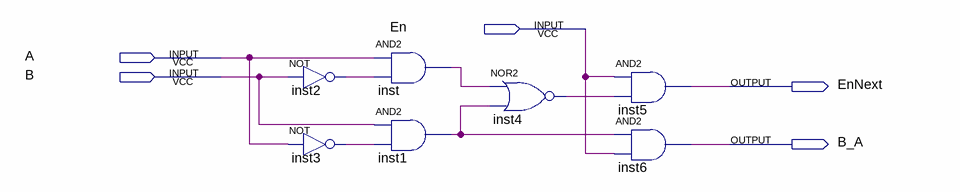
[diagram p0: schematic sheet]
// Quartus schematic Comparador_1bit.bdf as structural Verilog: 7 symbols, 5 pins
module Comparador_1bit (
  input  En,
  input  A,
  input  B,
  output EnNext,
  output B_A
);

  wire inst1_out, inst2_out, inst3_out, inst4_out, inst_out;

  not inst2 (inst2_out, B);
  not inst3 (inst3_out, A);
  and inst (inst_out, A, inst2_out);
  and inst1 (inst1_out, B, inst3_out);
  nor inst4 (inst4_out, inst_out, inst1_out);
  and inst5 (EnNext, En, inst4_out);
  and inst6 (B_A, inst1_out, En);
endmodule
